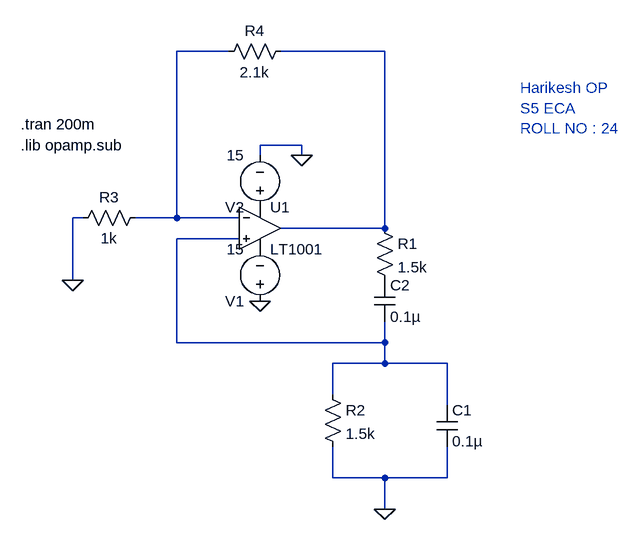
[diagram p0: schematic WEINBRIDGE_OSCILLATOR.asc]
WEINBRIDGE_OSCILLATOR.asc, the LTspice schematic file:
Version 4
SHEET 1 880 680
WIRE 144 -80 64 -80
WIRE 384 -80 224 -80
WIRE 256 64 192 64
WIRE 192 80 192 64
WIRE 256 80 256 64
WIRE -80 176 -96 176
WIRE 64 176 64 -80
WIRE 64 176 0 176
WIRE 160 176 64 176
WIRE 384 192 384 -80
WIRE 384 192 224 192
WIRE 160 208 64 208
WIRE -96 272 -96 176
WIRE 64 368 64 208
WIRE 384 368 384 336
WIRE 384 368 64 368
WIRE 384 400 384 368
WIRE 384 400 304 400
WIRE 480 400 384 400
WIRE 304 448 304 400
WIRE 480 464 480 400
WIRE 304 576 304 528
WIRE 384 576 304 576
WIRE 480 576 480 528
WIRE 480 576 384 576
WIRE 384 624 384 576
FLAG 384 624 0
FLAG -96 272 0
FLAG 256 80 0
FLAG 192 304 0
SYMBOL res 368 176 R0
SYMATTR InstName R1
SYMATTR Value 1.5k
SYMBOL cap 464 464 R0
SYMATTR InstName C1
SYMATTR Value 0.1µ
SYMBOL res 288 432 R0
SYMATTR InstName R2
SYMATTR Value 1.5k
SYMBOL cap 368 272 R0
SYMATTR InstName C2
SYMATTR Value 0.1µ
SYMBOL res 16 160 R90
WINDOW 0 0 56 VBottom 2
WINDOW 3 32 56 VTop 2
SYMATTR InstName R3
SYMATTR Value 1k
SYMBOL res 240 -96 R90
WINDOW 0 0 56 VBottom 2
WINDOW 3 32 56 VTop 2
SYMATTR InstName R4
SYMATTR Value 2.1k
SYMBOL voltage 192 320 R180
WINDOW 123 0 0 Left 0
WINDOW 39 0 0 Left 0
SYMATTR InstName V1
SYMATTR Value 15
SYMBOL voltage 192 176 R180
WINDOW 123 0 0 Left 0
WINDOW 39 0 0 Left 0
SYMATTR InstName V2
SYMATTR Value 15
SYMBOL OpAmps\\LT1001 192 128 R0
SYMATTR InstName U1
TEXT -176 32 Left 2 !.tran 200m
TEXT -176 64 Left 2 !.lib opamp.sub
TEXT 592 -24 Left 2 ;Harikesh OP\nS5 ECA \nROLL NO : 24

The netlist it stands for:
* WEINBRIDGE_OSCILLATOR.asc
R1 N002 P001 1.5k
C1 N003 0 0.1µ
R2 N003 0 1.5k
C2 P001 N003 0.1µ
R3 N001 0 1k
R4 N002 N001 2.1k
V1 0 P002 15
V2 P003 0 15
XU1 N003 N001 P003 P002 N002 LT1001  ; pins In+ In- V+ V- OUT
.tran 200m
.lib opamp.sub
* Harikesh OP
* S5 ECA
* ROLL NO : 24
.lib LTC.lib
.backanno
.end